# EAGLE design BrightButtonFTDI (EAGLE 6.5.0)
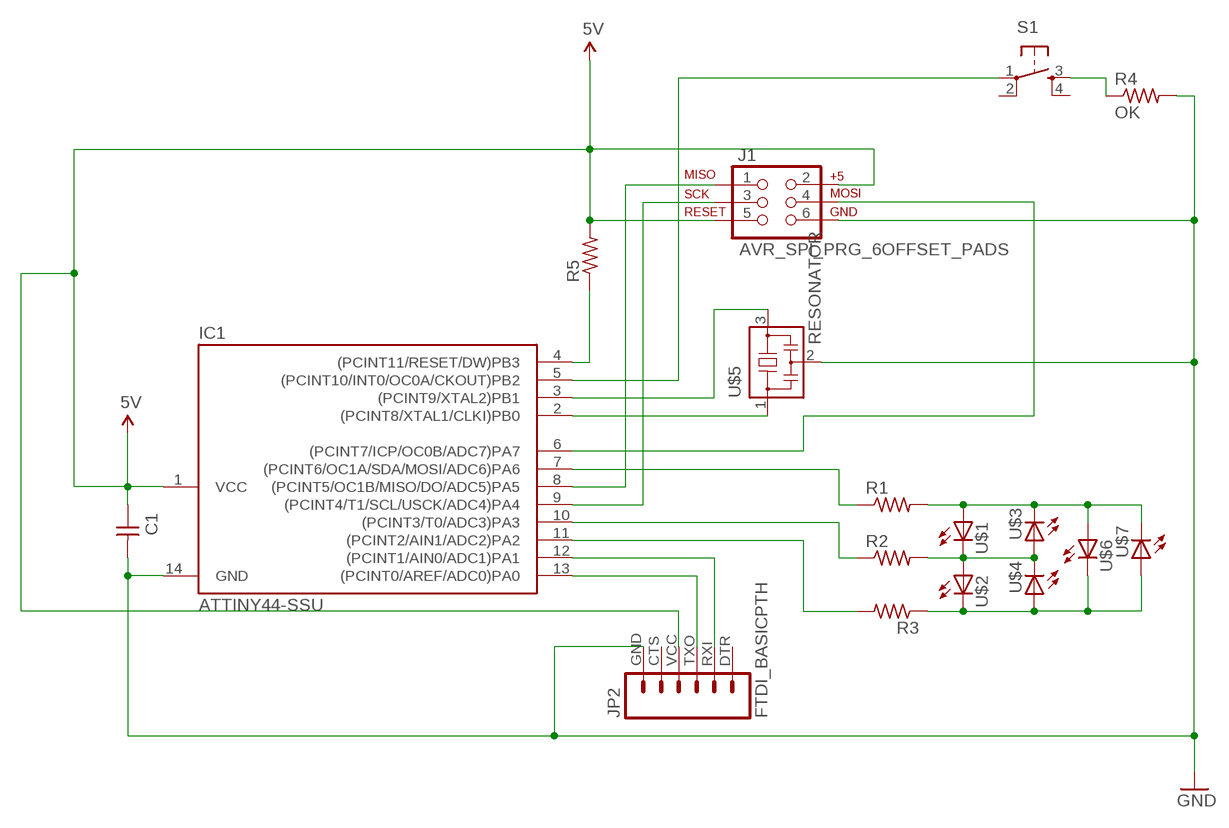
[diagram p0: schematic, sheet 1]

## Parts
C1  UNPOLARIZED_CAPACITOR1206  [1206]
IC1  ATTINY44-SSU  [SOIC14]
J1  AVR_SPI_PRG_6OFFSET_PADS  [2X3_OFFSET]
JP2  FTDI_BASICPTH  [FTDI_BASIC]
R1  RESISTOR1206  [1206]
R2  RESISTOR1206  [1206]
R3  RESISTOR1206  [1206]
R4  OK  RESISTOR1206  [1206]
R5  RESISTOR1206  [1206]
S1  6MM_SWITCH6MM_SWITCH  [6MM_SWITCH]
U$1  LED1206  [1206]
U$2  LED1206  [1206]
U$3  LED1206  [1206]
U$4  LED1206  [1206]
U$5  RESONATOR  [EFOBM]
U$6  LED1206  [1206]
U$7  LED1206  [1206]

## Nets
5V: C1.1 IC1.1(VCC) J1.2 J1.5 JP2.VCC R5.2
GND: C1.2 IC1.14(GND) JP2.GND R4.2 U$5.2
N$1: R2.2 U$1.2(C) U$2.1(A) U$3.1(A) U$4.2(C)
N$2: IC1.13((PCINT0/AREF/ADC0)PA0) JP2.TXO
N$3: R1.2 U$1.1(A) U$3.2(C) U$6.1(A) U$7.2(C)
N$4: R3.1 U$2.2(C) U$4.1(A) U$6.2(C) U$7.1(A)
N$5: R4.1 S1.3(S)
N$6: IC1.12((PCINT1/AIN0/ADC1)PA1) JP2.RXI
N$7: IC1.2((PCINT8/XTAL1/CLKI)PB0) U$5.1
N$8: IC1.3((PCINT9/XTAL2)PB1) U$5.3
N$9: IC1.4((PCINT11/RESET/DW)PB3) R5.1
N$10: IC1.8((PCINT5/OC1B/MISO/DO/ADC5)PA5) J1.1
N$11: IC1.9((PCINT4/T1/SCL/USCK/ADC4)PA4) J1.3
N$12: IC1.6((PCINT7/ICP/OC0B/ADC7)PA7) J1.4
N$13: IC1.5((PCINT10/INT0/OC0A/CKOUT)PB2) S1.1(P)
N$14: IC1.7((PCINT6/OC1A/SDA/MOSI/ADC6)PA6) R1.1
N$15: IC1.10((PCINT3/T0/ADC3)PA3) R2.1
N$16: IC1.11((PCINT2/AIN1/ADC2)PA2) R3.2
Unconnected: J1.6 JP2.CTS JP2.DTR S1.2(P1) S1.4(S1)

## Library data of the parts
C1 = FAB_Hello:UNPOLARIZED_CAPACITOR: unpolarized_capacitor
IC1 = FAB_Hello:ATTINY44
J1 = SparkFun-Connectors:AVR_SPI_PRG_6: AVR ISP 6 Pin This is the reduced ISP connector for AVR programming. Common on Arduino. This footprint will take up less PCB space and can be used with a 10-pin to 6-pin adapter such as SKU: BOB-08508
JP2 = SparkFun-Connectors:FTDI_BASIC: FTDI Basic header with labels
R1-R5 = FAB_Hello:RESISTOR
S1 = FAB_Hello:6MM_SWITCH: OMRON SWITCH
U$1-U$4 U$6 U$7 = FAB_Hello:LED
U$5 = fab:RESONATOR

## Board
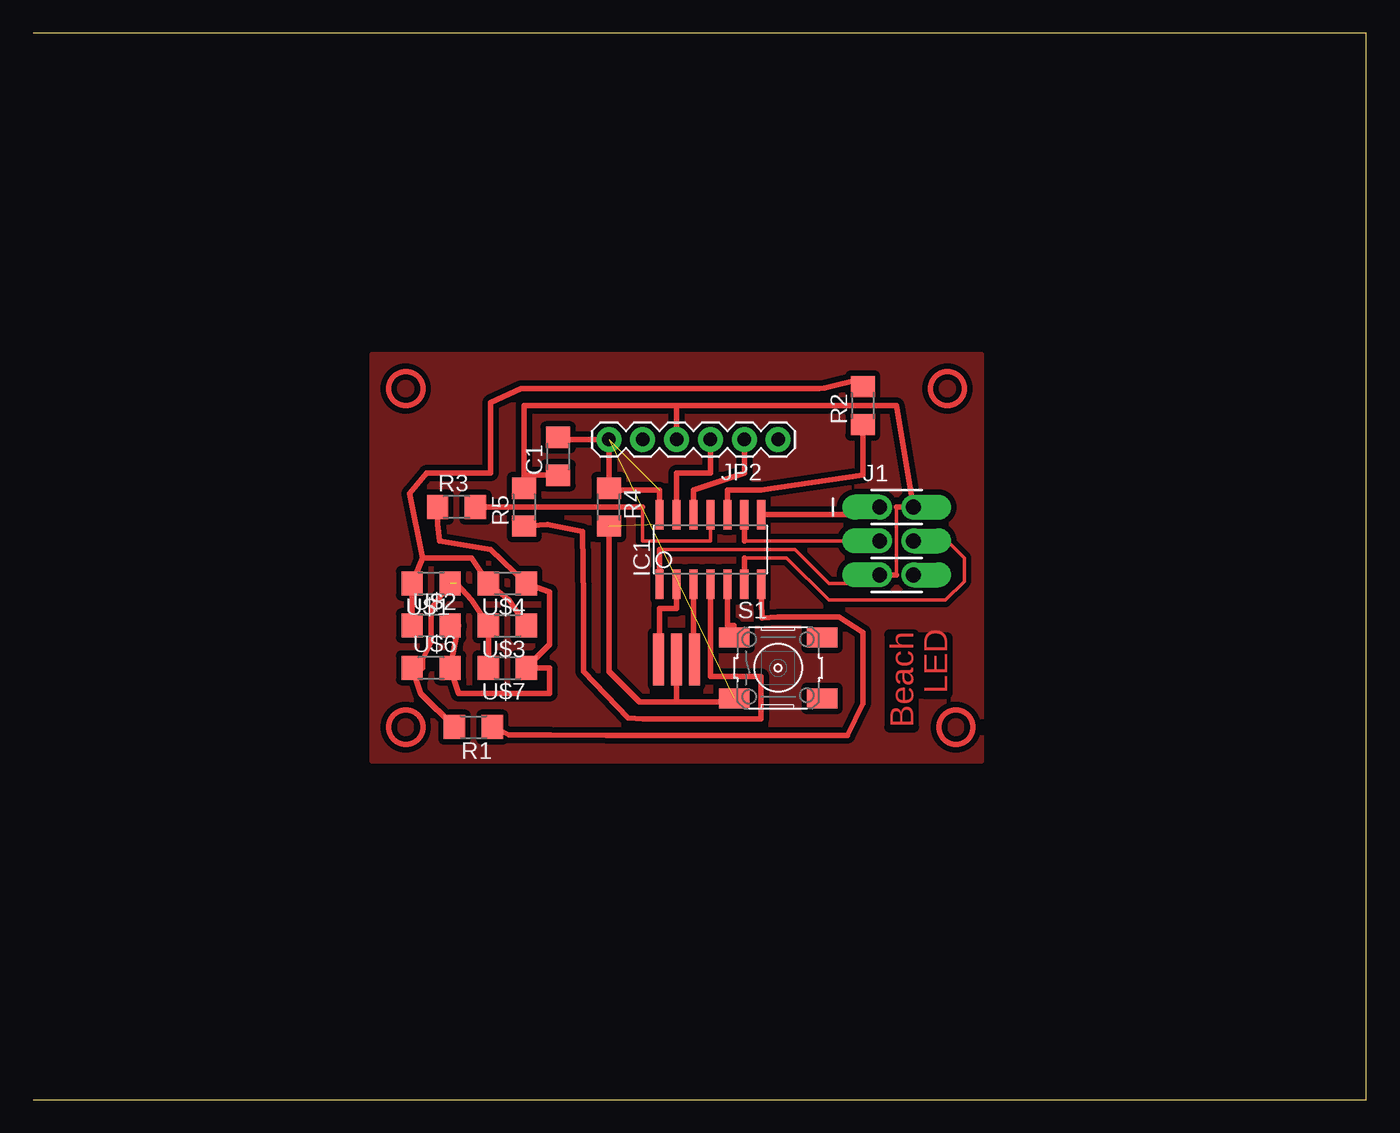
[diagram p1: board, top side]

Size 100 x 80 mm. Coordinates in mm from the lower left corner, seen from the top.
Outline: 0,0 100,0 100,80 0,80
Copper layers (1*16): Top 0.035mm / dielectric 1.5mm / Bottom 0.035mm
Design rules "default *": minimum track width 16mil, minimum drill 24mil, track to track 16mil, track to pad 16mil, pad to pad 16mil, via to via 16mil, smd to smd 16mil, copper to edge 40mil, drill to drill 16mil, minimum pad ring 10mil, minimum via ring 8mil, stop-mask expansion 4mil, vias tented up to drill 0mil, thermal gap 10mil

### Footprints (pad centres in the part's own frame; a part is rotated, then mirrored left to right if it is on the bottom)
1206 = smd 1.6 x 1.803: 1 -1.422,0; 2 1.422,0
SOIC14 = smd 0.61 x 2.21: 1 -3.81,-2.603; 2 -2.54,-2.603; 3 -1.27,-2.603; 4 0,-2.603; 5 1.27,-2.603; 6 2.54,-2.603; 7 3.81,-2.603; 8 3.81,2.603; 9 2.54,2.603; 10 1.27,2.603; 11 0,2.603; 12 -1.27,2.603; 13 -2.54,2.603; 14 -3.81,2.603
2X3_OFFSET = drill 1.118 pad 1.88 offset: 1 -2.54,-1.27; 2 -2.54,1.27; 3 0,-1.27; 4 0,1.27; 5 2.54,-1.27; 6 2.54,1.27
FTDI_BASIC = drill 1.016 pad 1.88: CTS 10.16,0; DTR 0,0; GND 12.7,0; RXI 2.54,0; TXO 5.08,0; VCC 7.62,0
6MM_SWITCH = smd 2.286 x 1.524: 1 -3.302,2.286; 2 3.302,2.286; 3 -3.302,-2.286; 4 3.302,-2.286
EFOBM = smd 0.8 x 3.9: 1 -1.35,0; 2 0,0; 3 1.35,0

### Placement (x,y rotation side)
C1  39.37,48.26 90 top
IC1  50.8,41.27 0 top
J1  64.77,41.91 270 top
JP2  55.88,49.53 180 top
R1  33.02,27.94 180 top
R2  62.23,52.07 90 top
R3  31.75,44.45 0 top
R4  43.18,44.45 270 top
R5  36.83,44.45 90 top
S1  55.88,32.38 0 top
U$1  29.84,38.73 180 top
U$2  29.84,35.56 0 top
U$3  35.56,35.56 180 top
U$4  35.56,38.73 180 top
U$5  48.26,33.02 0 top
U$6  29.84,32.38 0 top
U$7  35.56,32.38 180 top

### Tracks (layer width: path | path; a pad name or v marks a point on that pad's centre or on a via)
5V
  Top 0.254: 64.77,44.45 64.77,39.37 | 46.99,41.27 57.15,41.27 59.69,38.73 63.5,38.73
  Top 0.406: 64.77,44.45 J1.2 64.77,52.07 48.26,52.07 | 64.77,39.37 J1.5 63.5,38.73 | IC1.1 46.99,41.27 | JP2.VCC 48.26,52.07 | 48.26,52.07 36.83,52.07 36.83,46.84 | C1.1 36.83,46.84 | 36.83,46.84 R5.2
GND  (2 unrouted)
  Top 0.406: 46.99,43.18 IC1.14 46.99,45.72 | R4.2 43.18,32.13 45.47,29.84 48.26,29.84 | 48.26,29.84 52.7,29.84 | U$5.2 48.26,29.84 | JP2.GND 39.37,49.53 C1.2
N$1
  Top 0.406: U$2.1 U$1.2 29.21,40.64 | 29.21,40.64 32.87,40.64 U$4.2 35.71,37.47 U$3.1 | R2.2 62.23,54.08 59.37,53.39 58.95,53.34 36.61,53.34 34.29,52.29 34.29,46.99 29.49,46.99 28.24,45.47 29.21,40.64
N$2
  Top 0.406: JP2.TXO 50.8,46.99 48.26,46.99 IC1.13 48.26,43.18
N$3  (1 unrouted)
  Top 0.406: R1.2 29.06,30.48 U$6.1 29.21,32.38 29.21,33.02 29.84,34.29 29.84,36.83 31.75,39.37 31.75,38.73 | U$1.1 31.75,38.73 | 31.75,38.73 32.87,37.47 U$3.2 U$7.2
N$4
  Top 0.406: R3.1 30.33,43.18 30.48,41.91 34.29,41.27 U$4.1 38.73,38.1 38.73,34.14 U$7.1 38.73,32.38 38.73,30.48 33.66,30.48 31.9,30.48 U$6.2 31.9,35.56 U$2.2
N$5  (1 unrouted)
  Top 0.406: 46.99,45.72 43.18,45.72 R4.1 43.18,49.53
N$6
  Top 0.406: JP2.RXI 53.34,46.99 49.53,45.72 IC1.12 49.53,43.18
N$7
  Top 0.406: U$5.1 46.99,33.02 46.99,36.83 48.26,36.83 IC1.2
N$8
  Top 0.406: U$5.3 49.53,33.02 IC1.3
N$9
  Top 0.406: R5.1 38.58,43.15 41.2,42.62 41.27,37.47 41.27,32.13 44.62,28.62 45.76,28.57 54.61,28.57 54.61,31.75 50.8,31.75 IC1.4
N$10
  Top 0.406: IC1.8 63.5,43.88 J1.1
N$11
  Top 0.254: J1.3 53.34,41.91
  Top 0.406: 53.34,41.91 IC1.9
N$12
  Top 0.254: 53.34,40.64 56.52,40.64 59.69,37.47 68.43,37.47 69.85,38.88 69.85,40.64 68.58,41.91
  Top 0.406: IC1.6 53.34,40.64 | 68.58,41.91 J1.4
N$13
  Top 0.406: IC1.5 52.07,35.56 52.58,35.56 S1.1
N$14
  Top 0.406: IC1.7 54.67,36.13 55.88,36.2 60.43,36.2 62.23,35.03 62.23,29.74 61.07,27.3 43.01,27.3 38.82,27.36 35.71,27.36 R1.1
N$15
  Top 0.406: R2.1 62.23,46.84 54.61,45.72 52.07,45.72 IC1.10
N$16
  Top 0.254: 45.72,44.45 45.72,41.91 50.8,41.91 IC1.11
  Top 0.406: R3.2 45.72,44.45
N$17
  pour Top: 25.4,55.88 71.12,55.88 71.12,25.4 25.4,25.4
(copper drawn outside any net)
  shapes: Top circle x4

### Text on the board
Top: LED | Beach